# Altium schematic sheet Sheet5.SchDoc
size A3
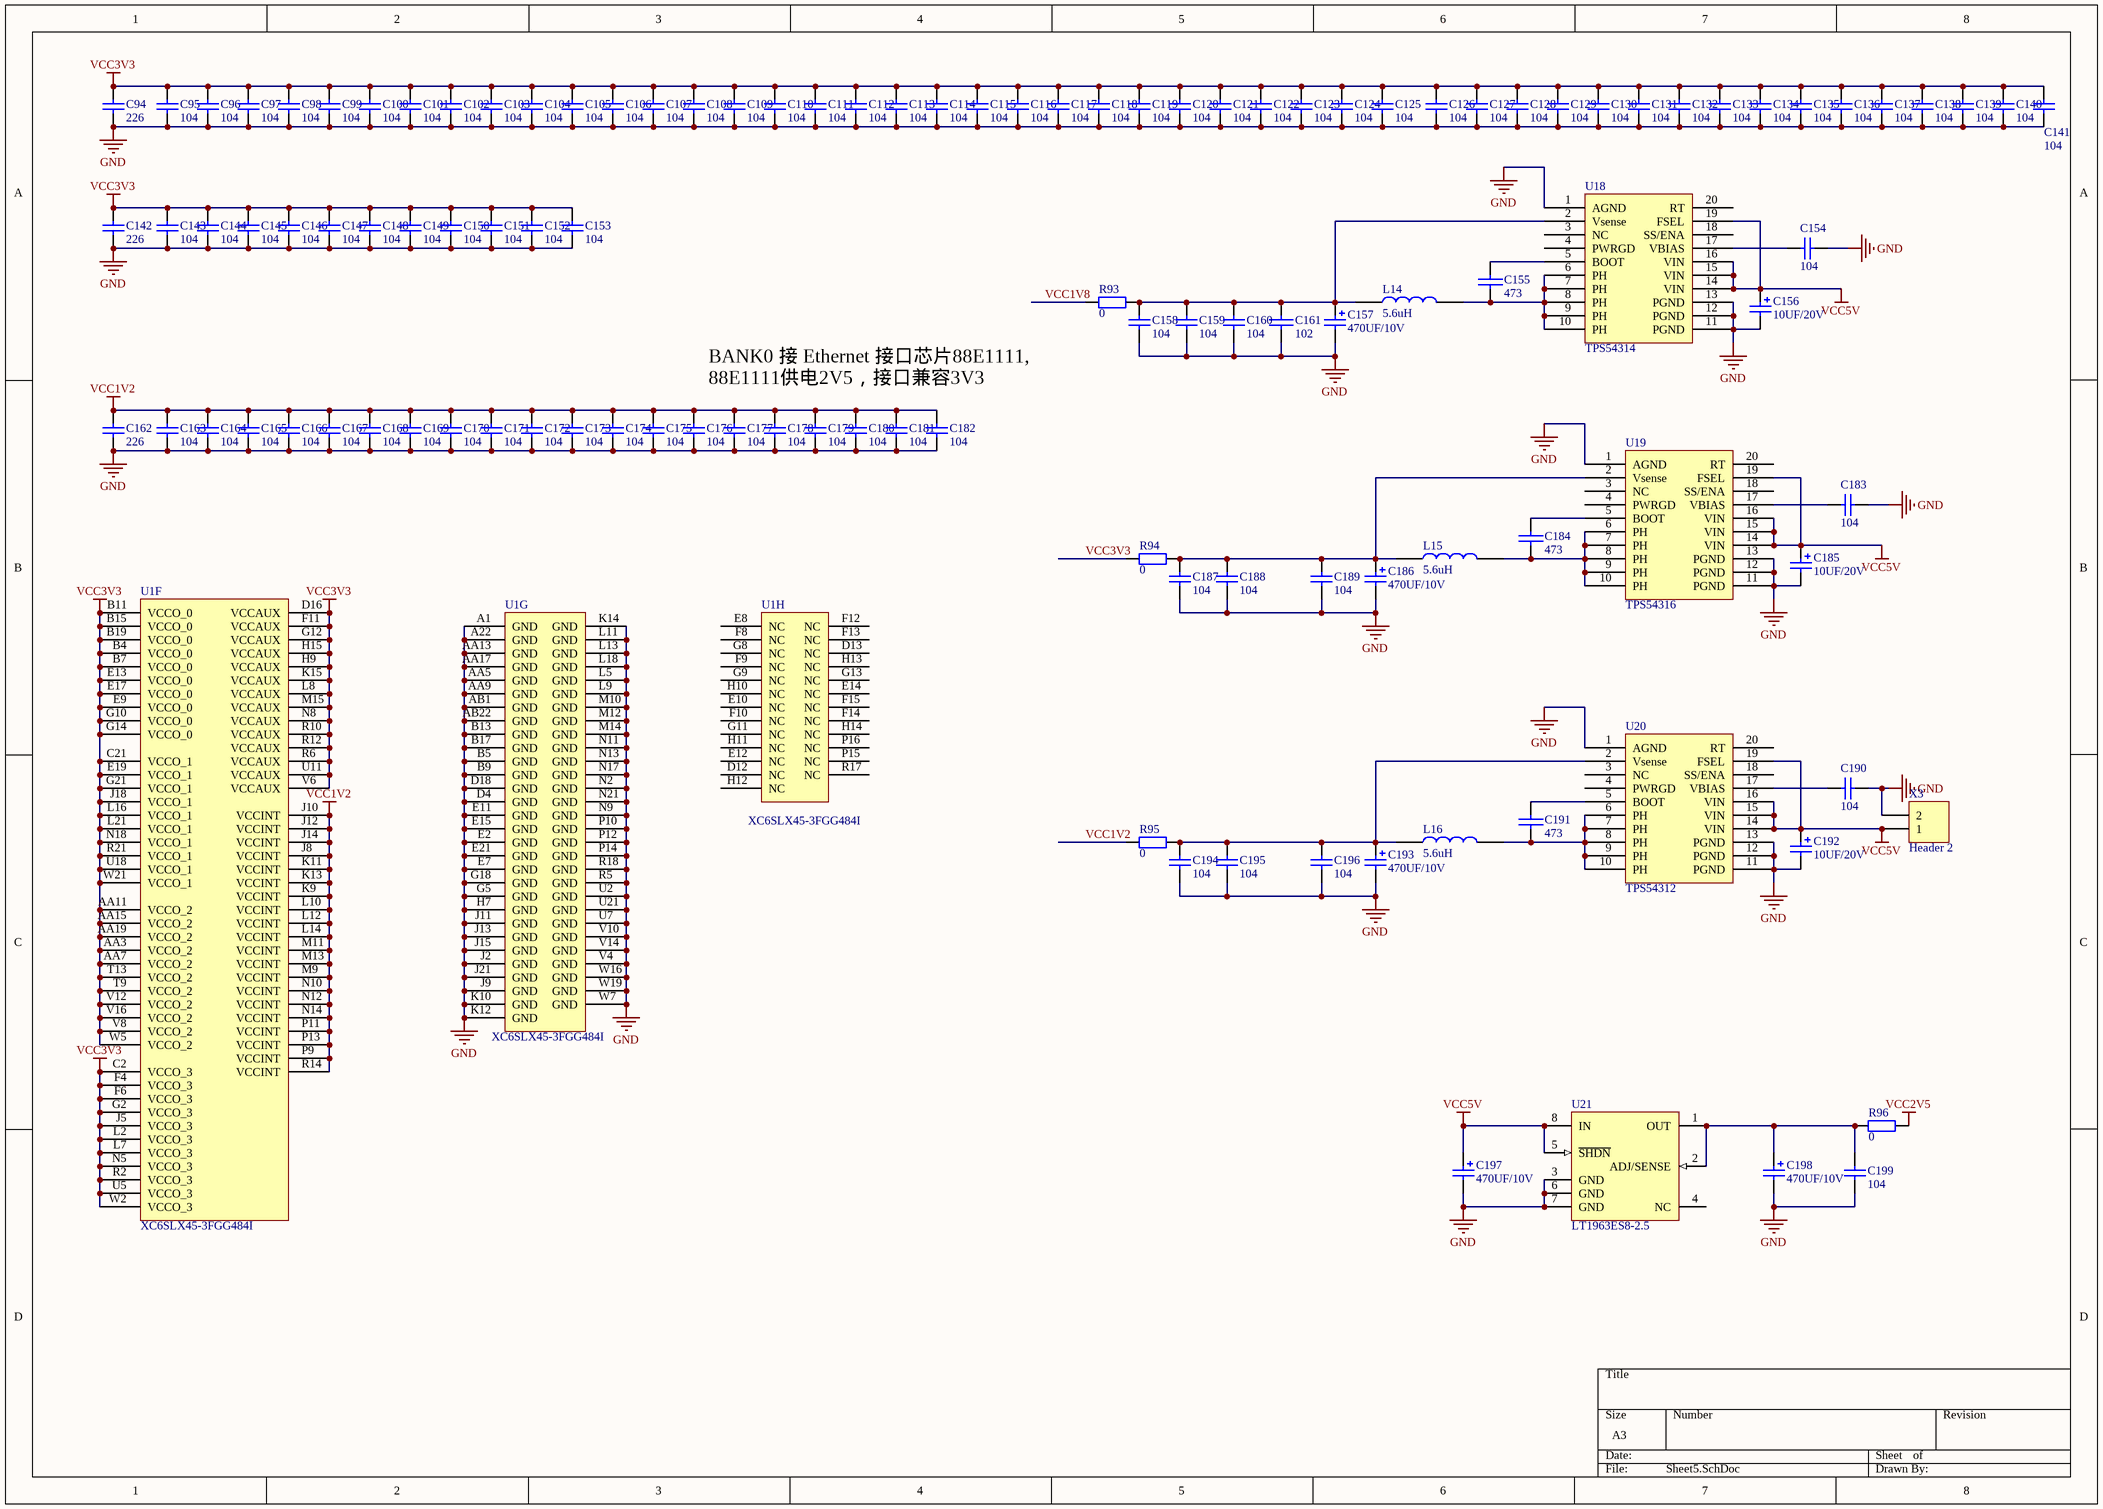
[diagram p0: Sheet5.SchDoc]

## Parts
C94  226  [0603]
C95  104  [0402]
C96  104  [0402]
C97  104  [0402]
C98  104  [0402]
C99  104  [0402]
C100  104  [0402]
C101  104  [0402]
C102  104  [0402]
C103  104  [0402]
C104  104  [0402]
C105  104  [0402]
C106  104  [0402]
C107  104  [0402]
C108  104  [0402]
C109  104  [0402]
C110  104  [0402]
C111  104  [0402]
C112  104  [0402]
C113  104  [0402]
C114  104  [0402]
C115  104  [0402]
C116  104  [0402]
C117  104  [0402]
C118  104  [0402]
C119  104  [0402]
C120  104  [0402]
C121  104  [0402]
C122  104  [0402]
C123  104  [0402]
C124  104  [0402]
C125  104  [0402]
C126  104  [0402]
C127  104  [0402]
C128  104  [0402]
C129  104  [0402]
C130  104  [0402]
C131  104  [0402]
C132  104  [0402]
C133  104  [0402]
C134  104  [0402]
C135  104  [0402]
C136  104  [0402]
C137  104  [0402]
C138  104  [0402]
C139  104  [0402]
C140  104  [0402]
C141  104  [0402]
C142  226  [0603]
C143  104  [0402]
C144  104  [0402]
C145  104  [0402]
C146  104  [0402]
C147  104  [0402]
C148  104  [0402]
C149  104  [0402]
C150  104  [0402]
C151  104  [0402]
C152  104  [0402]
C153  104  [0402]
C154  104  [0402]
C155  473  [0402]
C156  10UF/20V  [CAP-B]
C157  470UF/10V  [CAP-D]
C158  104  [0402]
C159  104  [0402]
C160  104  [0402]
C161  102  [0402]
C162  226  [0603]
C163  104  [0402]
C164  104  [0402]
C165  104  [0402]
C166  104  [0402]
C167  104  [0402]
C168  104  [0402]
C169  104  [0402]
C170  104  [0402]
C171  104  [0402]
C172  104  [0402]
C173  104  [0402]
C174  104  [0402]
C175  104  [0402]
C176  104  [0402]
C177  104  [0402]
C178  104  [0402]
C179  104  [0402]
C180  104  [0402]
C181  104  [0402]
C182  104  [0402]
C183  104  [0402]
C184  473  [0402]
C185  10UF/20V  [CAP-B]
C186  470UF/10V  [CAP-D]
C187  104  [0402]
C188  104  [0402]
C189  104  [0402]
C190  104  [0402]
C191  473  [0402]
C192  10UF/20V  [CAP-B]
C193  470UF/10V  [CAP-D]
C194  104  [0402]
C195  104  [0402]
C196  104  [0402]
C197  470UF/10V  [CAP-D]
C198  470UF/10V  [CAP-D]
C199  104  [0402]
L14  5.6uH  [L5R2]
L15  5.6uH  [L5R2]
L16  5.6uH  [L5R2]
R93  0  [0603]
R94  0  [0603]
R95  0  [0603]
R96  0  [0603]
U1  XC6SLX45-3FGG484I  [FGG484]  (parts F,G,H of 8)
U18  TPS54314  [SOP20]
U19  TPS54316  [SOP20]
U20  TPS54312  [SOP20]
U21  LT1963ES8-2.5  [so_8]
X3  Header 2  [HDR1X2]

## Nets
GND: C94.1 C95.1 C96.1 C97.1 C98.1 C99.1 C100.1 C101.1 C102.1 C103.1 C104.1 C105.1 C106.1 C107.1 C108.1 C109.1 C110.1 C111.1 C112.1 C113.1 C114.1 C115.1 C116.1 C117.1 C118.1 C119.1 C120.1 C121.1 C122.1 C123.1 C124.1 C125.1 C126.1 C127.1 C128.1 C129.1 C130.1 C131.1 C132.1 C133.1 C134.1 C135.1 C136.1 C137.1 C138.1 C139.1 C140.1 C141.1 C142.1 C143.1 C144.1 C145.1 C146.1 C147.1 C148.1 C149.1 C150.1 C151.1 C152.1 C153.1 C154.1 C156.2 C157.2 C158.1 C159.1 C160.1 C161.1 C162.1 C163.1 C164.1 C165.1 C166.1 C167.1 C168.1 C169.1 C170.1 C171.1 C172.1 C173.1 C174.1 C175.1 C176.1 C177.1 C178.1 C179.1 C180.1 C181.1 C182.1 C183.1 C185.2 C186.2 C187.1 C188.1 C189.1 C190.1 C192.2 C193.2 C194.1 C195.1 C196.1 C197.2 C198.2 C199.1 U1.A1(GND) U1.A22(GND) U1.AA5(GND) U1.AA9(GND) U1.AA13(GND) U1.AA17(GND) U1.AB1(GND) U1.AB22(GND) U1.B5(GND) U1.B9(GND) U1.B13(GND) U1.B17(GND) U1.D4(GND) U1.D18(GND) U1.E2(GND) U1.E7(GND) U1.E11(GND) U1.E15(GND) U1.E21(GND) U1.G5(GND) U1.G18(GND) U1.H7(GND) U1.J2(GND) U1.J9(GND) U1.J11(GND) U1.J13(GND) U1.J15(GND) U1.J21(GND) U1.K10(GND) U1.K12(GND) U1.K14(GND) U1.L5(GND) U1.L9(GND) U1.L11(GND) U1.L13(GND) U1.L18(GND) U1.M10(GND) U1.M12(GND) U1.M14(GND) U1.N2(GND) U1.N9(GND) U1.N11(GND) U1.N13(GND) U1.N17(GND) U1.N21(GND) U1.P10(GND) U1.P12(GND) U1.P14(GND) U1.R5(GND) U1.R18(GND) U1.U2(GND) U1.U7(GND) U1.U21(GND) U1.V4(GND) U1.V10(GND) U1.V14(GND) U1.W7(GND) U1.W16(GND) U1.W19(GND) U18.1(AGND) U18.11(PGND) U18.12(PGND) U18.13(PGND) U19.1(AGND) U19.11(PGND) U19.12(PGND) U19.13(PGND) U20.1(AGND) U20.11(PGND) U20.12(PGND) U20.13(PGND) U21.3(GND) U21.6(GND) U21.7(GND) X3.2
VCC1V2: C162.2 C163.2 C164.2 C165.2 C166.2 C167.2 C168.2 C169.2 C170.2 C171.2 C172.2 C173.2 C174.2 C175.2 C176.2 C177.2 C178.2 C179.2 C180.2 C181.2 C182.2 R95.2 U1.J8(VCCINT) U1.J10(VCCINT) U1.J12(VCCINT) U1.J14(VCCINT) U1.K9(VCCINT) U1.K11(VCCINT) U1.K13(VCCINT) U1.L10(VCCINT) U1.L12(VCCINT) U1.L14(VCCINT) U1.M9(VCCINT) U1.M11(VCCINT) U1.M13(VCCINT) U1.N10(VCCINT) U1.N12(VCCINT) U1.N14(VCCINT) U1.P9(VCCINT) U1.P11(VCCINT) U1.P13(VCCINT) U1.R14(VCCINT)
VCC2V5: R96.1
VCC3V3: C94.2 C95.2 C96.2 C97.2 C98.2 C99.2 C100.2 C101.2 C102.2 C103.2 C104.2 C105.2 C106.2 C107.2 C108.2 C109.2 C110.2 C111.2 C112.2 C113.2 C114.2 C115.2 C116.2 C117.2 C118.2 C119.2 C120.2 C121.2 C122.2 C123.2 C124.2 C125.2 C126.2 C127.2 C128.2 C129.2 C130.2 C131.2 C132.2 C133.2 C134.2 C135.2 C136.2 C137.2 C138.2 C139.2 C140.2 C141.2 C142.2 C143.2 C144.2 C145.2 C146.2 C147.2 C148.2 C149.2 C150.2 C151.2 C152.2 C153.2 R94.2 U1.AA3(VCCO_2) U1.AA7(VCCO_2) U1.AA11(VCCO_2) U1.AA15(VCCO_2) U1.AA19(VCCO_2) U1.B4(VCCO_0) U1.B7(VCCO_0) U1.B11(VCCO_0) U1.B15(VCCO_0) U1.B19(VCCO_0) U1.C2(VCCO_3) U1.C21(VCCO_1) U1.D16(VCCAUX) U1.E9(VCCO_0) U1.E13(VCCO_0) U1.E17(VCCO_0) U1.E19(VCCO_1) U1.F4(VCCO_3) U1.F6(VCCO_3) U1.F11(VCCAUX) U1.G2(VCCO_3) U1.G10(VCCO_0) U1.G12(VCCAUX) U1.G14(VCCO_0) U1.G21(VCCO_1) U1.H9(VCCAUX) U1.H15(VCCAUX) U1.J5(VCCO_3) U1.J18(VCCO_1) U1.K15(VCCAUX) U1.L2(VCCO_3) U1.L7(VCCO_3) U1.L8(VCCAUX) U1.L16(VCCO_1) U1.L21(VCCO_1) U1.M15(VCCAUX) U1.N5(VCCO_3) U1.N8(VCCAUX) U1.N18(VCCO_1) U1.R2(VCCO_3) U1.R6(VCCAUX) U1.R10(VCCAUX) U1.R12(VCCAUX) U1.R21(VCCO_1) U1.T9(VCCO_2) U1.T13(VCCO_2) U1.U5(VCCO_3) U1.U11(VCCAUX) U1.U18(VCCO_1) U1.V6(VCCAUX) U1.V8(VCCO_2) U1.V12(VCCO_2) U1.V16(VCCO_2) U1.W2(VCCO_3) U1.W5(VCCO_2) U1.W21(VCCO_1)
VCC5V: C156.1 C185.1 C192.1 C197.1 U18.14(VIN) U18.15(VIN) U18.16(VIN) U18.19(FSEL) U19.14(VIN) U19.15(VIN) U19.16(VIN) U19.19(FSEL) U20.14(VIN) U20.15(VIN) U20.16(VIN) U20.19(FSEL) U21.5(~{SHDN}) U21.8(IN) X3.1
VCC1V8: R93.2
NetC154_2: C154.2 U18.17(VBIAS)
NetC155_1: C155.1 L14.2 U18.6(PH) U18.7(PH) U18.8(PH) U18.9(PH) U18.10(PH)
NetC155_2: C155.2 U18.5(BOOT)
NetC157_1: C157.1 C158.2 C159.2 C160.2 C161.2 L14.1 R93.1 U18.2(Vsense)
NetC183_2: C183.2 U19.17(VBIAS)
NetC184_1: C184.1 L15.2 U19.6(PH) U19.7(PH) U19.8(PH) U19.9(PH) U19.10(PH)
NetC184_2: C184.2 U19.5(BOOT)
NetC186_1: C186.1 C187.2 C188.2 C189.2 L15.1 R94.1 U19.2(Vsense)
NetC190_2: C190.2 U20.17(VBIAS)
NetC191_1: C191.1 L16.2 U20.6(PH) U20.7(PH) U20.8(PH) U20.9(PH) U20.10(PH)
NetC191_2: C191.2 U20.5(BOOT)
NetC193_1: C193.1 C194.2 C195.2 C196.2 L16.1 R95.1 U20.2(Vsense)
NetC198_1: C198.1 C199.2 R96.2 U21.1(OUT) U21.2(ADJ/SENSE)

Not connected (* = marked no-connect by the designer): U1 D12(NC) D13(NC) E8(NC) E10(NC) E12(NC) E14(NC) F8(NC) F9(NC) F10(NC) F12(NC) F13(NC) F14(NC) F15(NC) G8(NC) G9(NC) G11(NC) G13(NC) H10(NC) H11(NC) H12(NC) H13(NC) H14(NC) P15(NC) P16(NC) R17(NC); U18 3(NC) 4(PWRGD) 18(SS/ENA) 20(RT); U19 3(NC) 4(PWRGD) 18(SS/ENA) 20(RT); U20 3(NC) 4(PWRGD) 18(SS/ENA) 20(RT); U21 4(NC)

## Notes on the sheet
- BANK0 接 Ethernet 接口芯片88E1111, 88E1111供电2V5，接口兼容3V3

## Library data of the parts
C94-C154 C158-C160 C162-C183 C187-C190 C194-C196 C199 = Cap: Capacitor; Value: 0.1uF; Published: 8-Jun-2000; LatestRevisionDate: 17-Jul-2002; LatestRevisionNote: Re-released for DXP Platform.; PackageReference: RAD-0.3; Publisher: Altium Limited
C155 C161 C184 C191 = CAP: Capacitor
C156 C157 C185 C186 C192 C193 C197 C198 = Cap Pol2: Polarized Capacitor (Axial); Value: 100pF; Published: 8-Jun-2000; LatestRevisionDate: 17-Jul-2002; LatestRevisionNote: Re-released for DXP Platform.; PackageReference: POLAR0.8; Publisher: Altium Limited
L14-L16 = INDUCTOR1
R93-R96 = Res2: Resistor; Value: 47R; Published: 8-Jun-2000; LatestRevisionDate: 17-Jul-2002; LatestRevisionNote: Re-released for DXP Platform.; PackageReference: AXIAL-0.4; Publisher: Altium Limited
U1 = XC6SLX45-3FGG484I: Spartan-6 LX 1.2V FPGA, 316 User I/Os, 484-Ball Fine-Pitch BGA (1.0mm Pitch), Speed Grade 3, Industrial Grade, Pb-Free; FirstPublished: 17-Nov-2009; DatasheetVersion: ver1.3, Nov-2009; PackageVersion: ver1.1, Dec-2008; PackageReference: FGG484; Publisher: Altium Limited; PackageDescription: 484-Ball Fine Pitch Ball Grid Array 1.00 mm Pitch (FGG484) - Pb-Free; Code_JEDEC: MS-034-AAJ-1; Code_IPC: BGA100P22X22-484; ComponentLink1Description: Spartan-6 Datasheet; ComponentLink1URL: http://www.xilinx.com/support/documentation/data_sheets/ds160.pdf; ComponentLink2Description: Pinout Specification; ComponentLink2URL: http://www.xilinx.com/support/documentation/user_guides/ug385.pdf; ComponentLink3Description: FGG484 Package Drawing; ComponentLink3URL: http://www.xilinx.com/support/documentation/package_specs/fg484.pdf; ComponentLink4Description: Spartan-6 Documents; ComponentLink4URL: http://www.xilinx.com/support/documentation/spartan-6.htm; ComponentLink5Description: Xilinx.com Home; ComponentLink5URL: http://www.xilinx.com
U18 U19 = TPS54312
U21 = LT1962EMS8: 300mA, Low Noise, Micropower Low Dropout Regulator; Note: 1916; Published: 30-May-2008; DatasheetVersion: Aug-2007; PackageVersion: revA, 2000; PackageReference: MS8; Publisher: Altium Limited; PackageDescription: 8-Pin Thin Small Outline Package 0.65 mm Pitch; ComponentLink1Description: Manufacturer Link; ComponentLink1URL: http://www.linear.com/; ComponentLink2Description: Datasheet; ComponentLink2URL: http://www.linear.com/pc/downloadDocument.do?navId=H0,C1,C1003,C1040,C1055,P1378,D3343
X3 = Header 2: Header, 2-Pin; LatestRevisionDate: 17-Jul-2002; LatestRevisionNote: Re-released for DXP Platform.; Publisher: Altium Limited